# EAGLE design RTC_PCF8563 (EAGLE 5.06)

## Sheet 1 of 3
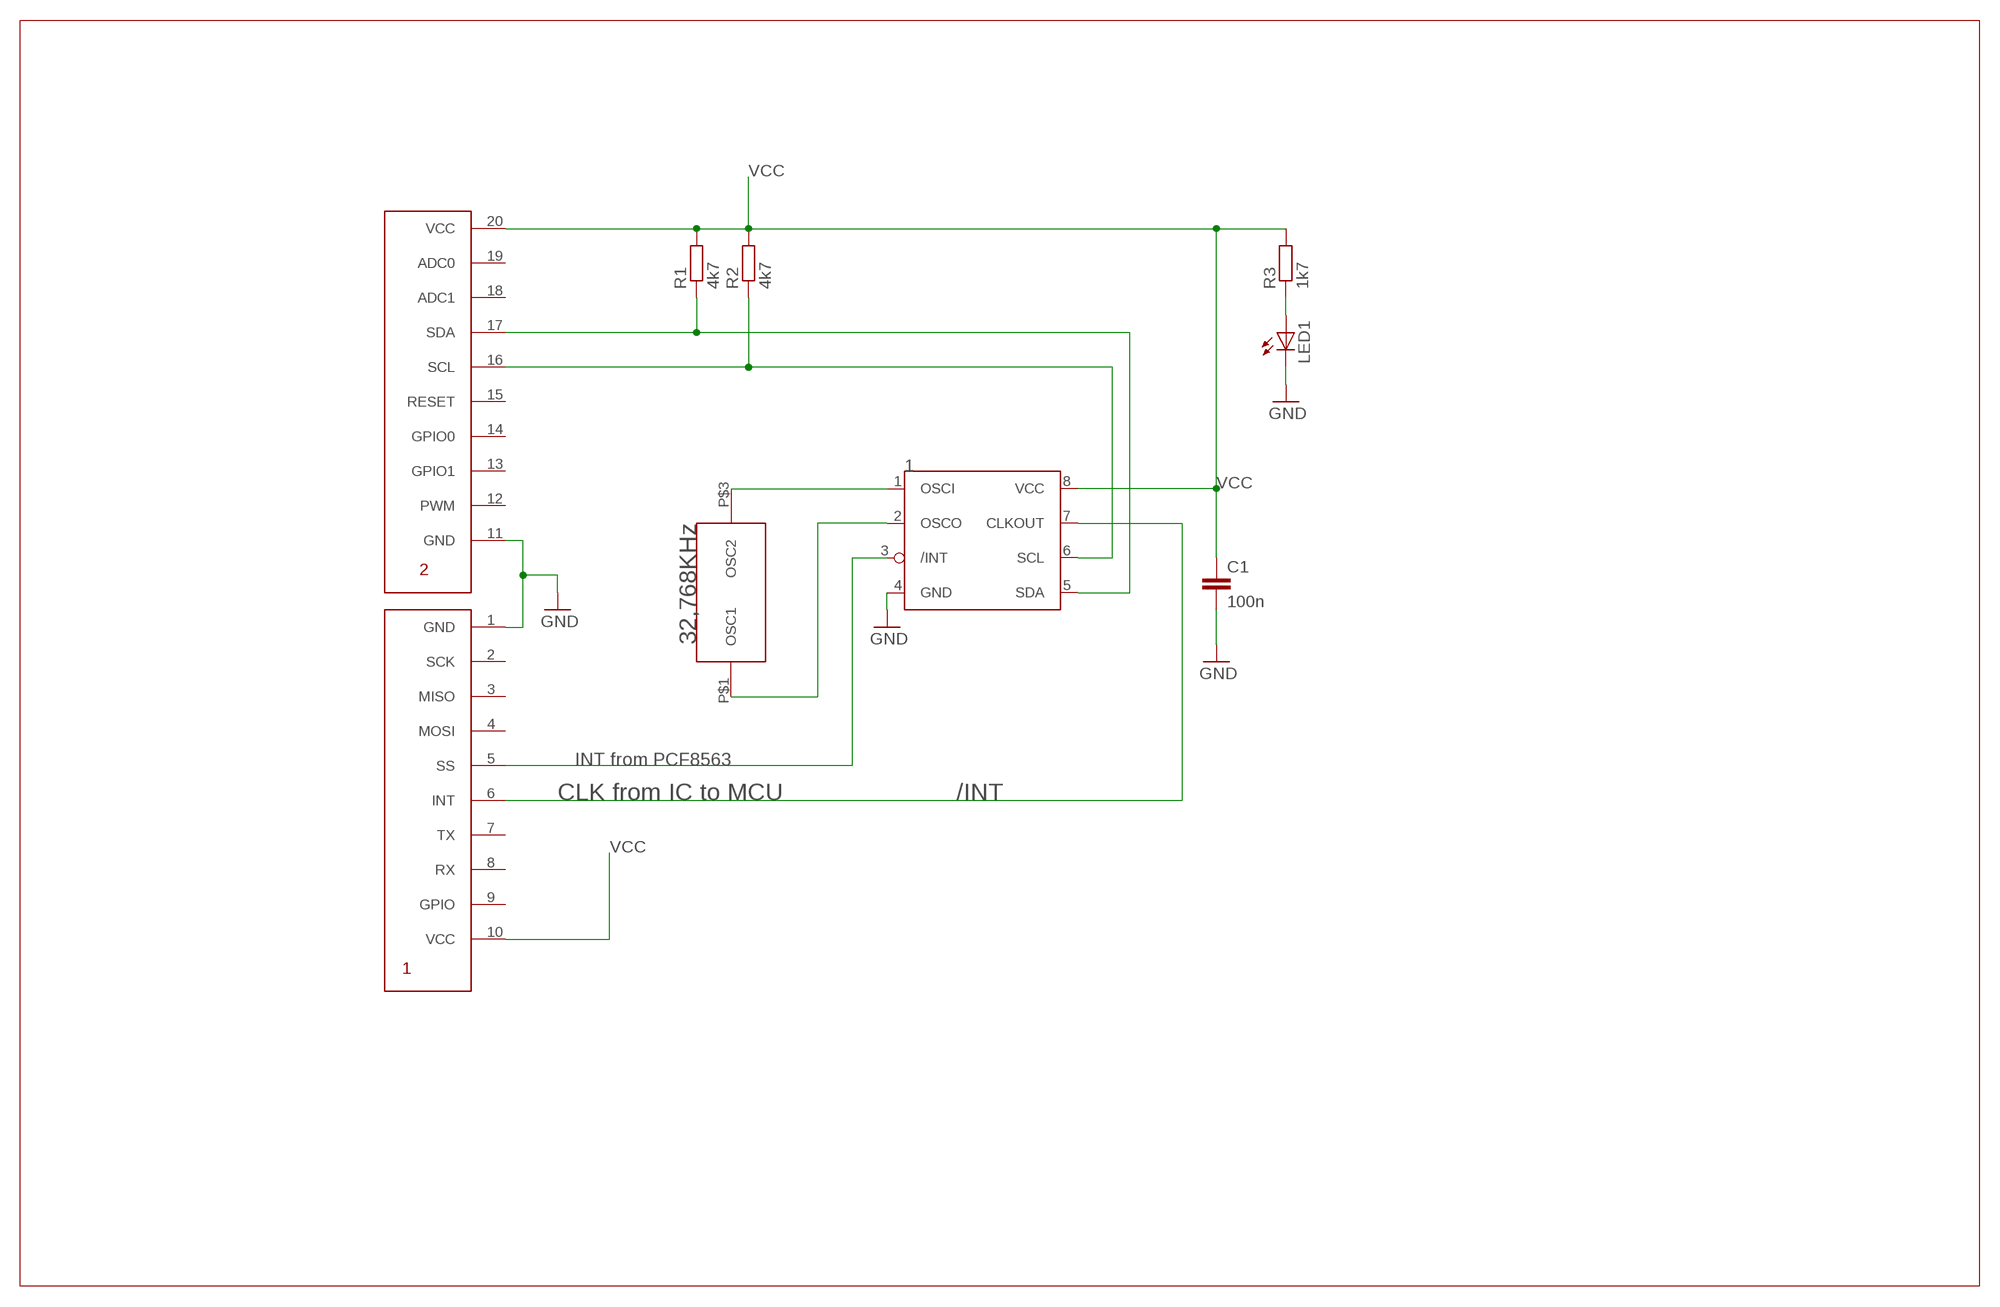
[diagram p0: schematic, sheet 1]

### Parts
1  PCF  [SO08]
32.768  37KHZ  [37KHZSMD]
C1  100n  C-EUC1206  [C1206]
LED1  LEDCHIPLED_1206  [CHIPLED_1206]
MM1  MMSYS_CONECTOR  [MMSYSTEMS_CON]
R1  4k7  R-EU_M1206  [M1206]
R2  4k7  R-EU_M1206  [M1206]
R3  1k7  R-EU_M1206  [M1206]

### Nets
GND: 1.4(GND) C1.2 LED1.C MM1.1(GND) MM1.11(GND)
N$1: 1.6(SCL) MM1.16(SCL) R2.1
N$2: 1.5(SDA) MM1.17(SDA) R1.1
N$3: LED1.A R3.1
N$4: 1.3(/INT) MM1.5(SS)
N$5: 1.7(CLKOUT) MM1.6(INT)
N$6: 1.2(OSCO) 32.768.P$1(OSC1)
N$7: 1.1(OSCI) 32.768.P$3(OSC2)
VCC: 1.8(VCC) C1.1 MM1.10(VCC) MM1.20(VCC) R1.2 R2.2 R3.2
Unconnected: MM1.2(SCK) MM1.3(MISO) MM1.4(MOSI) MM1.7(TX) MM1.8(RX) MM1.9(GPIO) MM1.12(PWM) MM1.13(GPIO1) MM1.14(GPIO0) MM1.15(RESET) MM1.18(ADC1) MM1.19(ADC0)

### Notes on the sheet
- 32,768KHz
- INT from PCF8563
- CLK from IC to MCU | /INT

## Sheet 2 of 3
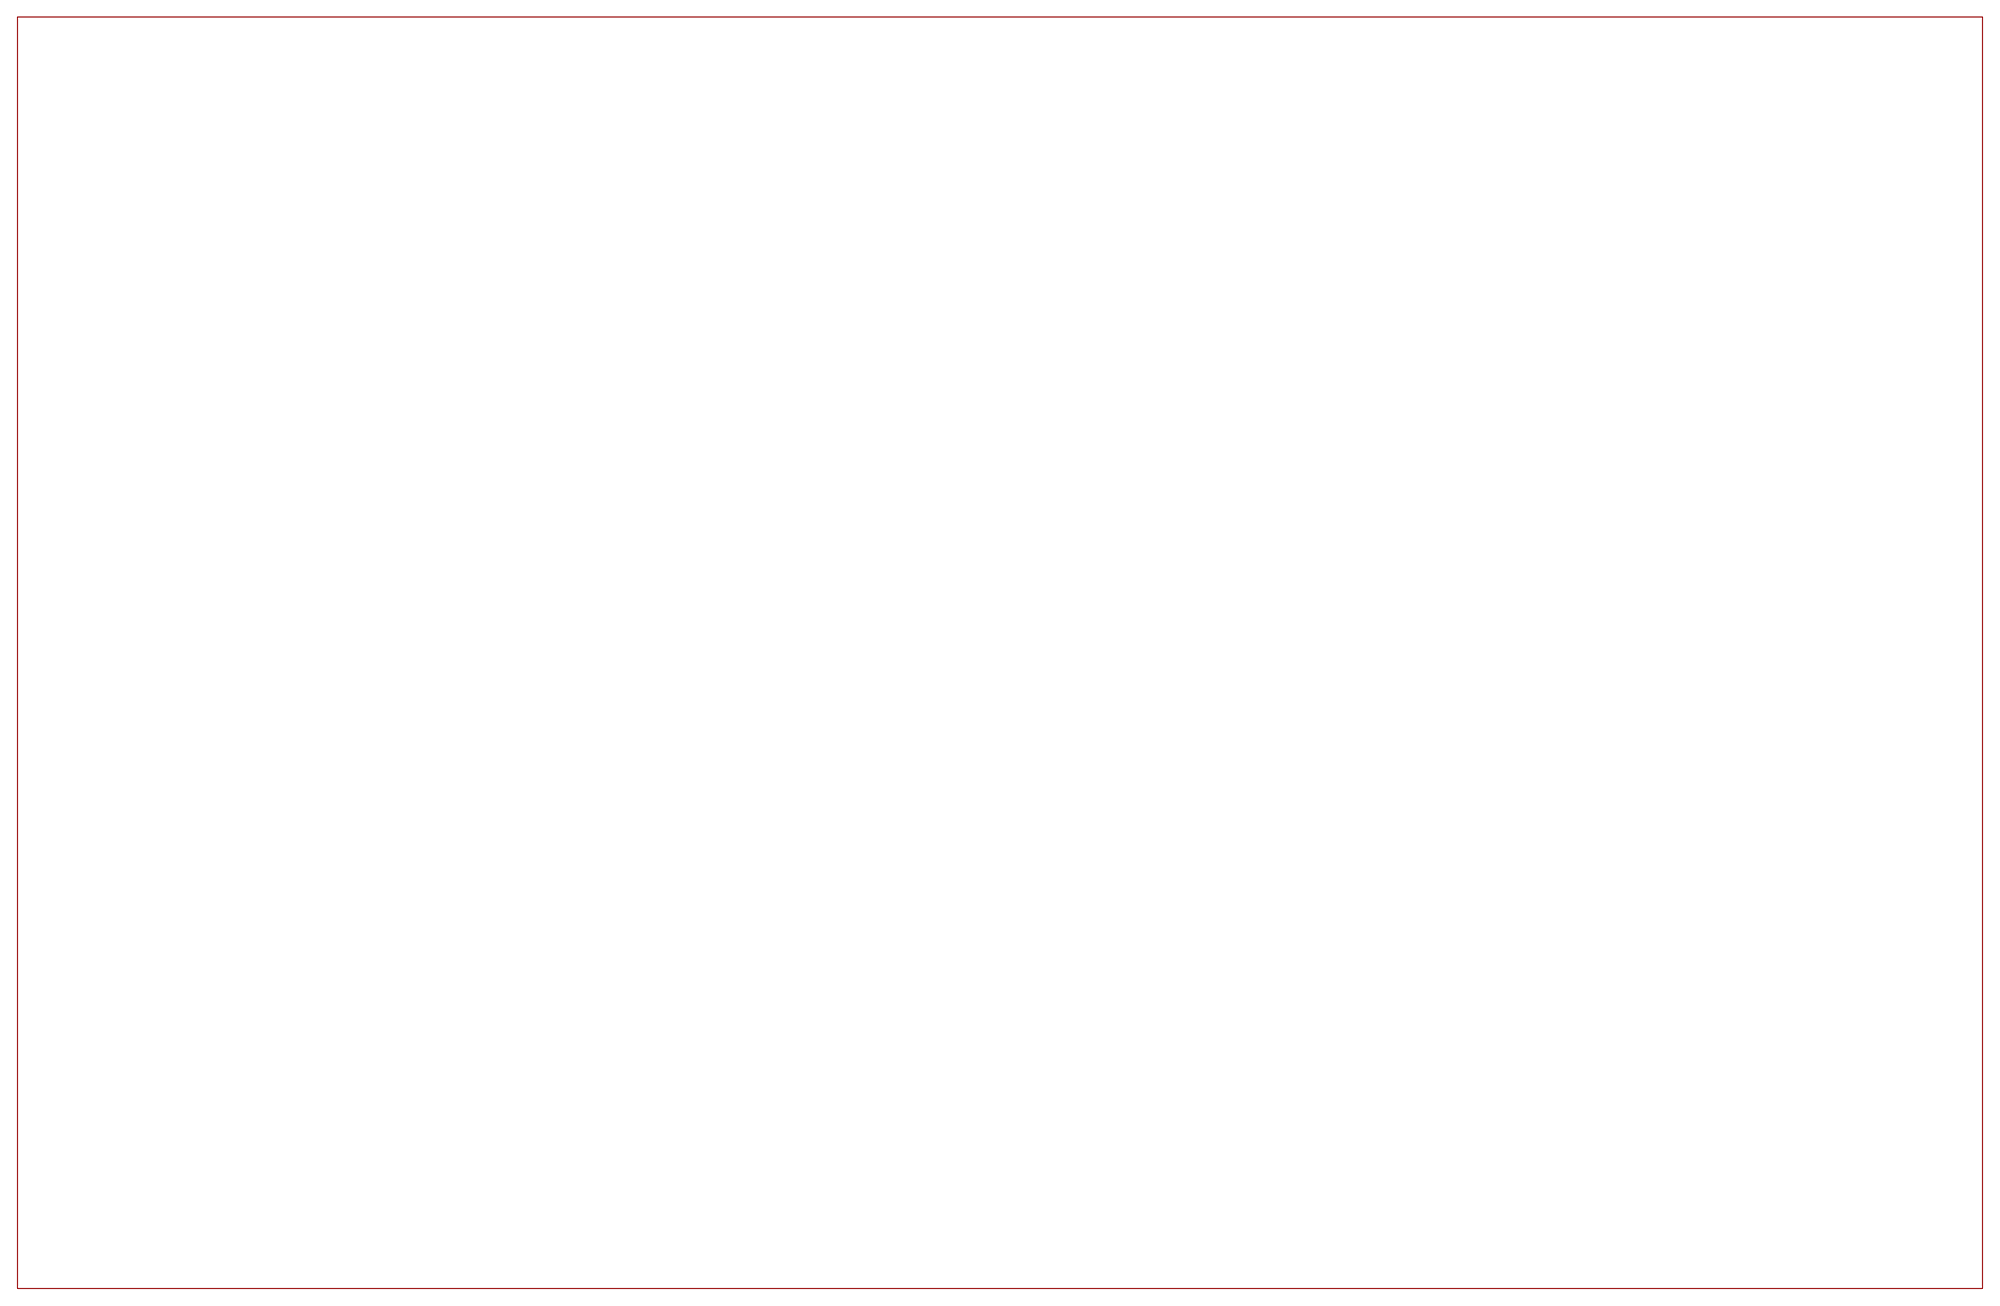
[diagram p1: schematic, sheet 2]

## Sheet 3 of 3
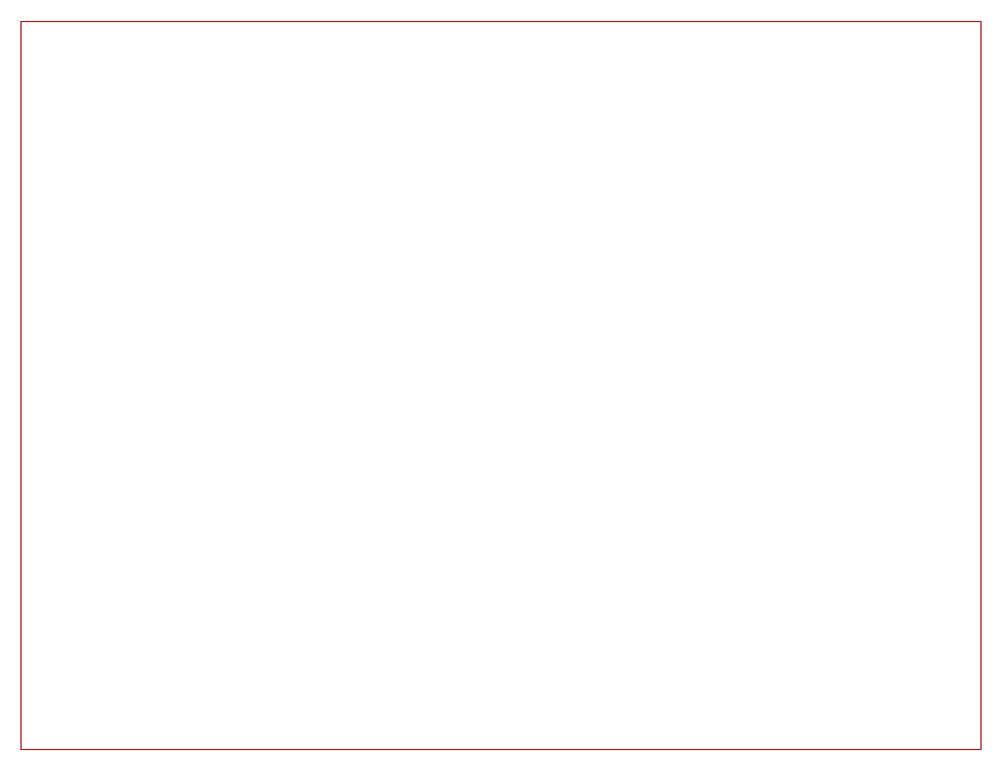
[diagram p2: schematic, sheet 3]

## Library data of the parts
1 = pcf8563:PCF
32.768 = pcf8563:37KHZ
C1 = resistor:C-EU: CAPACITOR, European symbol
LED1 = led:LED: LED OSRAM: - CHIPLED LG R971, LG N971, LY N971, LG Q971, LY Q971, LO R971, LY R971 LH N974, LH R974 LS Q976, LO Q976, LY Q976 LO Q996 - Hyper CHIPLED LW Q18S LB Q993, LB Q99A, LB R99A - SideLED LS A670, LO A670, LY A670, LG A670, LP A670 LB A673, LV A673, LT A673, LW A673 LH A674 LY A675 LS A676, LA A676, LO A676, LY A676, LW A676 LS A679, LY A679, LG A679 - Hyper Micro SIDELED® LS Y876, LA Y876, LO Y876, LY Y876 LT Y87S - SmartLED LW L88C, LW L88S LB L89C, LB L89S, LG L890 LS L89K, LO L89K, LY L89K LS L896, LA L896, LO L896, LY L896 - TOPLED LS T670, LO T670, LY T670, LG T670, LP T670 LSG T670, LSP T670, LSY T670, LOP T670, LYG T670 LG T671, LOG T671, LSG T671 LB T673, LV T673, LT T673, LW T673 LH T674 LS T676, LA T676, LO T676, LY T676, LB T676, LH T676, LSB T676, LW T676 LB T67C, LV T67C, LT T67C, LS T67K, LO T67K, LY T67K, LW E67C LS E67B, LA E67B, LO E67B, LY E67B, LB E67C, LV E67C, LT E67C LW T67C LS T679, LY T679, LG T679 LS T770, LO T770, LY T770, LG T770, LP T770 LB T773, LV T773, LT T773, LW T773 LH T774 LS E675, LA E675, LY E675, LS T675 LS T776, LA T776, LO T776, LY T776, LB T776 LHGB T686 LT T68C, LB T68C - Hyper Mini TOPLED® LB M676 - Mini TOPLED Santana® LG M470 LS M47K, LO M47K, LY M47K Source: http://www.osram.convergy.de LUXEON: - LUMILED® LXK2-PW12-R00, LXK2-PW12-S00, LXK2-PW14-U00, LXK2-PW14-V00 LXK2-PM12-R00, LXK2-PM12-S00, LXK2-PM14-U00 LXK2-PE12-Q00, LXK2-PE12-R00, LXK2-PE12-S00, LXK2-PE14-T00, LXK2-PE14-U00 LXK2-PB12-K00, LXK2-PB12-L00, LXK2-PB12-M00, LXK2-PB14-N00, LXK2-PB14-P00, LXK2-PB14-Q00 LXK2-PR12-L00, LXK2-PR12-M00, LXK2-PR14-Q00, LXK2-PR14-R00 LXK2-PD12-Q00, LXK2-PD12-R00, LXK2-PD12-S00 LXK2-PH12-R00, LXK2-PH12-S00 LXK2-PL12-P00, LXK2-PL12-Q00, LXK2-PL12-R00 Source: www.luxeon.com KINGBRIGHT: KA-3528ASYC Source: www.kingbright.com
MM1 = atmega16u4:MMSYS_CONECTOR
R1-R3 = resistor:R-EU_: RESISTOR, European symbol

## Board
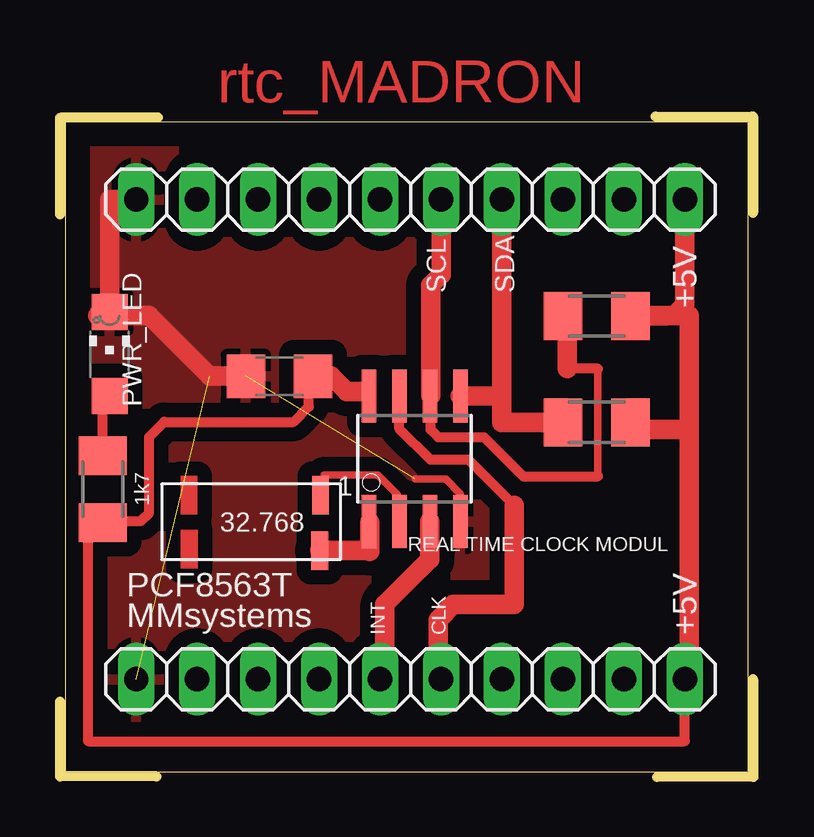
[diagram p3: board, top side]

Size 28.9 x 27.53 mm. Coordinates in mm from the lower left corner, seen from the top.
Outline: 4.03,0.02 0.01,0.02 0.01,3.13
Outline: 28.9,0 24.88,0
Outline: 28.88,4.07 28.88,0.05
Outline: 28.88,27.53 28.88,23.51
Outline: 24.81,27.53 28.83,27.53
Outline: 0.07,27.5 4.08,27.5
Outline: 0,23.46 0,27.47
Outline: 0.22,0.21 28.67,0.21 28.67,27.3 0.22,27.3 0.22,0.21
Copper layers (1*16): Top 0.035mm / dielectric 1.5mm / Bottom 0.035mm
Design rules "default": minimum track width 10mil, minimum drill 24mil, track to track 8mil, track to pad 8mil, pad to pad 8mil, via to via 8mil, smd to smd 8mil, copper to edge 40mil, drill to drill 8mil, minimum pad ring 10mil, minimum via ring 8mil, stop-mask expansion 4mil, vias tented up to drill 0mil, thermal gap 10mil
tRestrict: 1 lines

### Footprints (pad centres in the part's own frame; a part is rotated, then mirrored left to right if it is on the bottom)
SO08 = smd 0.61 x 2.21: 1 -1.905,-2.616; 2 -0.635,-2.616; 3 0.635,-2.616; 4 1.905,-2.616; 5 1.905,2.616; 6 0.635,2.616; 7 -0.635,2.616; 8 -1.905,2.616
37KHZSMD = smd 0.7 x 1.6: P$1 -2.65,-0.7; P$3 -2.62,1.61
C1206 = smd 1.6 x 1.8: 1 -1.4,0; 2 1.4,0
CHIPLED_1206 = smd 1.5 x 1.5: A 0,-1.75; C 0,1.75
MMSYSTEMS_CON = drill 1.016 long: 1 2,1; 2 4.54,1; 3 7.08,1; 4 9.62,1; 5 12.16,1; 6 14.7,1; 7 17.24,1; 8 19.78,1; 9 22.32,1; 10 24.86,1; 11 2,21; 12 4.54,21; 13 7.08,21; 14 9.62,21; 15 12.16,21; 16 14.7,21; 17 17.24,21; 18 19.78,21; 19 22.32,21; 20 24.86,21
M1206 = smd 1.6 x 2: 1 -1.4,0; 2 1.4,0

### Placement (x,y rotation side)
1  14.78,13.26 0 top
32.768  8.2,11.04 180 top
C1  9.15,16.7 180 top
LED1  2.07,17.62 0 top
MM1  1.18,3.07 0 top
R1  22.36,14.78 0 top
R2  22.36,19.21 0 top
R3  1.78,11.99 270 top

### Tracks (layer width: path | path; a pad name or v marks a point on that pad's centre or on a via)
GND  (2 unrouted)
  Top 0.305: 14.8,12.41 16.07,12.41 16.68,11.8 1.4
  Top 0.406: LED1.C 1.57,19.23
  Top 0.813: LED1.C 2.07,24.07 MM1.11 | C1.2 6.24,16.7 3.71,19.23 1.57,19.23
  pour Top (isolate 0.61): -1.05,28.11 30.65,28.11 30.65,-1.06 -1.05,-1.06
N$1
  Top 0.305: 22.41,12.52 22.41,17.01
  Top 0.406: 15.44,15.9 1.6 15.44,15.85 15.44,14.48 15.76,14.16 17.66,14.16 19.29,12.52 22.41,12.52 | 21.14,19.21 R2.1 | 22.41,17.01 21.14,17.01
  Top 0.813: 15.44,15.9 15.44,20.5 15.88,20.94 MM1.16 | 21.14,17.01 21.14,19.21
N$2
  Top 0.813: 1.5 18.42,15.88 | 18.42,15.88 MM1.17 | R1.1 18.42,14.78 18.42,15.88
N$3
  Top 0.406: R3.1 1.78,15.55 LED1.A
N$4
  Top 0.406: MM1.5 13.54,4.27
  Top 0.813: 1.3 15.41,9.06 13.54,7.19 13.54,4.27
N$5
  Top 0.406: 1.7 14.14,14.51 15.44,13.21 17.02,13.21 18.93,11.31 | MM1.6 15.76,4.19
  Top 0.813: 18.93,11.31 18.93,7.19 16.39,7.19 15.76,6.55 15.76,4.19
N$6
  Top 0.305: 11,11.96 11,12.58 13.24,12.58 14.05,11.76 14.05,10.73 1.2
  Top 0.406: 32.768.P$1 11,11.96 | 1.2 14.17,10.67
N$7
  Top 0.406: 12.88,9.43 12.9,9.41 | 12.9,10.61 1.1
  Top 0.813: 32.768.P$3 12.88,9.43 | 12.9,9.41 12.9,10.61
VCC
  Top 0.406: MM1.10 26.04,1.48 1.17,1.48 1.17,10.59 R3.2 1.86,10.67 3.39,10.67 3.71,10.99 3.71,14.16 4.34,14.79 9.73,14.79 10.37,15.43 10.37,16.52 C1.1 11.31,16.7 | 12.69,16.06 1.8
  Top 0.813: MM1.20 26.04,19.69 25.58,19.23 26.22,19.23 | 26.22,19.23 23.79,19.23 R2.2 25.24,19.21 26.22,19.23 | 26.22,14.48 26.22,19.23 | 26.22,14.48 24.07,14.48 R1.2 | 11.31,16.7 11.95,16.06 12.69,16.06 | 26.22,14.48 26.22,4.25 MM1.10

### Text on the board
Top: rtc_MADRON
tNames: SCL | SDA | +5V | PWR_LED | 1k7 | REAL TIME CLOCK MODUL | PCF8563T | MMsystems | INT | CLK | +5V